# Altium schematic sheet mcu.schdoc
size 324 x 125 mm
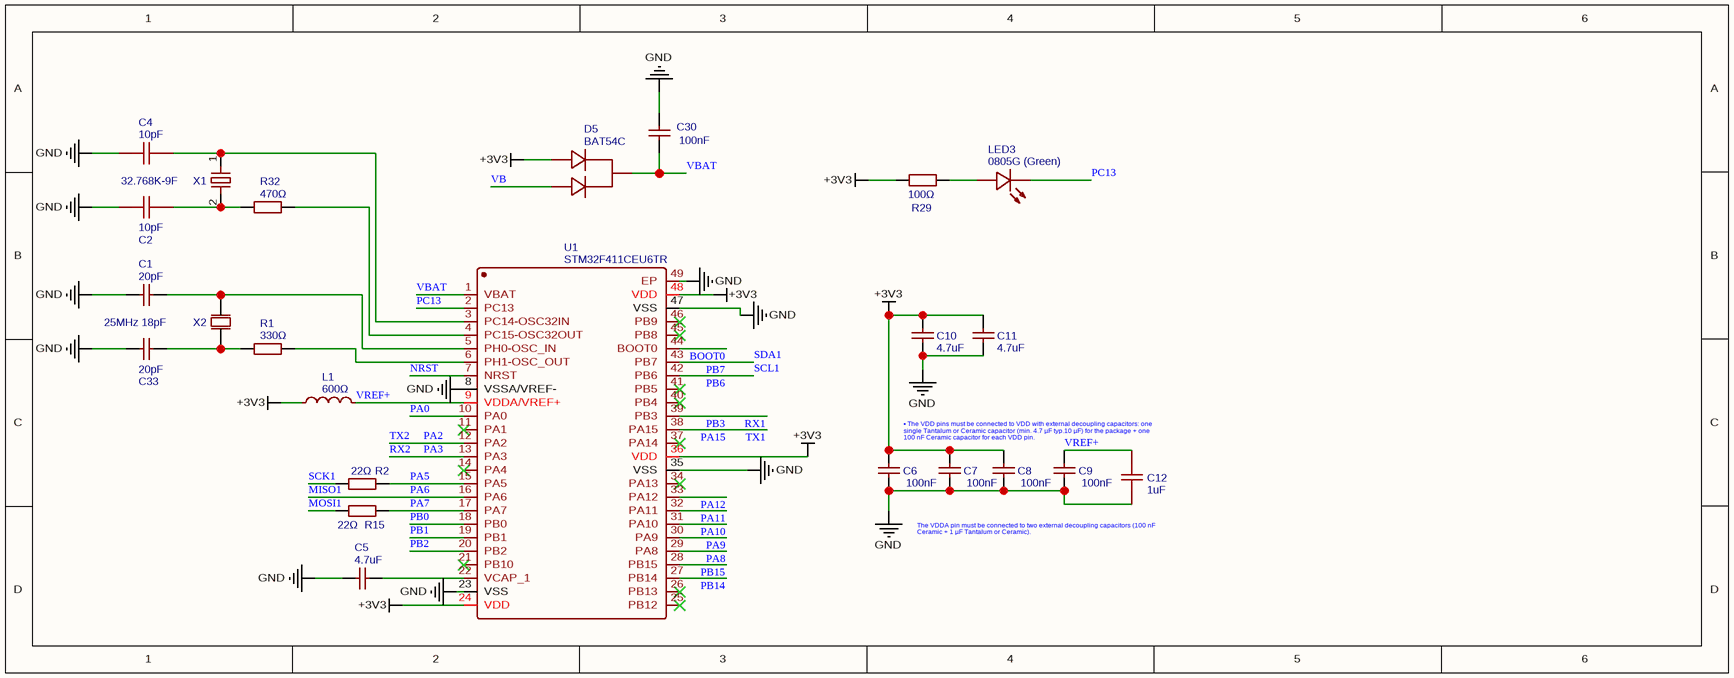
[diagram p0: mcu.schdoc]

## Parts
C1  20pF  [C0402]
C2  10pF  [C0402]
C4  10pF  [C0402]
C5  4.7uF  [C0402]
C6  100nF  [C0402]
C7  100nF  [C0402]
C8  100nF  [C0402]
C9  100nF  [C0402]
C10  4.7uF  [C0402]
C11  4.7uF  [C0402]
C12  1uF  [C0402]
C30  100nF  [C0402]
C33  20pF  [C0402]
D5  BAT54C  [SOT-23-3_L2.9-W1.6-P1.90-LS2.8-BR]
L1  600Ω  [L0603]
LED3  0805G (Green)  [LED0805-R-RD]
R1  330Ω  [R0402]
R2  22Ω  [R0402]
R15  22Ω  [R0402]
R29  100Ω  [R0402]
R32  470Ω  [R0402]
U1  STM32F411CEU6TR  [UFQFPN-48_L7.0-W7.0-P0.50-BL-EP5.6]
X1  32.768K-9F  [CRYSTAL-SMD_L3.2-W1.5-1]
X2  25MHz 18pF  [OSC-SMD_2P-L5.0-W3.2]

## Nets
+3V3: C6.2 C7.2 C8.2 C10.1 C11.1 D5.1(A1) L1.1 R29.1 U1.24(VDD) U1.36(VDD) U1.48(VDD)
GND: C1.1 C2.1 C4.1 C5.1 C6.1 C7.1 C8.1 C9.1 C10.2 C11.2 C12.1 C30.2 C33.1 U1.8(VSSA/VREF-) U1.23(VSS) U1.35(VSS) U1.47(VSS) U1.49(EP)
BOOT0: U1.44(BOOT0)
MISO1: U1.16(PA6)  [also labelled PA6]
MOSI1: R15.1
NRST: U1.7(NRST)
PA0: U1.10(PA0)
PA2: U1.12(PA2)  [also labelled TX2]
PA3: U1.13(PA3)  [also labelled RX2]
PA5: R2.2 U1.15(PA5)
PA7: R15.2 U1.17(PA7)
PA8: U1.29(PA8)
PA9: U1.30(PA9)
PA10: U1.31(PA10)
PA11: U1.32(PA11)
PA12: U1.33(PA12)
PA15: U1.38(PA15)  [also labelled TX1]
PB0: U1.18(PB0)
PB1: U1.19(PB1)
PB2: U1.20(PB2)
PB3: U1.39(PB3)  [also labelled RX1]
PB6: U1.42(PB6)  [also labelled SCL1]
PB7: U1.43(PB7)  [also labelled SDA1]
PB14: U1.27(PB14)
PB15: U1.28(PB15)
PC13: LED3.2(K) U1.2(PC13)
SCK1: R2.1
VB: D5.2(A2)
VBAT: C30.1 D5.3(K) U1.1(VBAT)
VREF+: C9.2 C12.2 L1.2 U1.9(VDDA/VREF+)
NetC1_2: C1.2 U1.5(PH0-OSC_IN) X2.1(OSC1)
NetC2_2: C2.2 R32.1 X1.2
NetC4_2: C4.2 U1.3(PC14-OSC32IN) X1.1
NetC5_2: C5.2 U1.22(VCAP_1)
NetC33_2: C33.2 R1.1 X2.2(OSC2)
NetLED3_1: LED3.1(A) R29.2
NetR1_2: R1.2 U1.6(PH1-OSC_OUT)
NetR32_2: R32.2 U1.4(PC15-OSC32OUT)

Not connected (* = marked no-connect by the designer): U1 11(PA1)* 14(PA4)* 21(PB10)* 25(PB12)* 26(PB13)* 34(PA13)* 37(PA14)* 40(PB4)* 41(PB5)* 45(PB8)* 46(PB9)*

## Notes on the sheet
- • The VDD pins must be connected to VDD with external decoupling capacitors: one
  single Tantalum or Ceramic capacitor (min. 4.7 µF typ.10 µF) for the package + one
  100 nF Ceramic capacitor for each VDD pin.
- The VDDA pin must be connected to two external decoupling capacitors (100 nF
  Ceramic + 1 µF Tantalum or Ceramic).

## Library data of the parts
C1 C33 = 20pF: Manufacturer: FH(风华); Manufacturer Part: 0402CG200J500NT; nameAlias: Value; Supplier: LCSC; Supplier Part: C1554; JLCPCB Part Class: Basic Part; spicePre: C; spiceSymbolName: 0402CG200J500NT
C2 C4 = 10pF: Manufacturer: SAMSUNG(三星); Manufacturer Part: CL05C100JB5NNNC; nameAlias: Value; Supplier: LCSC; Supplier Part: C32949; JLCPCB Part Class: Basic Part; spicePre: C; spiceSymbolName: CL05C100JB5NNNC
C5 C10 C11 = 4.7uF: Manufacturer Part: CL05A475MP5NRNC; Manufacturer: SAMSUNG(三星); nameAlias: Value; Supplier: LCSC; Supplier Part: C23733; JLCPCB Part Class: Basic Part; spicePre: C; spiceSymbolName: CL05A475MP5NRNC
C6-C9 C30 = 100nF: Manufacturer Part: CL05B104KO5NNNC; Manufacturer: SAMSUNG(三星); nameAlias: Value; Supplier: LCSC; Supplier Part: C1525; JLCPCB Part Class: Basic Part; spicePre: C; spiceSymbolName: CL05B104KO5NNNC
C12 = 1uF: Manufacturer: SAMSUNG(三星); Manufacturer Part: CL05A105KA5NQNC; nameAlias: Value; Supplier: LCSC; Supplier Part: C52923; JLCPCB Part Class: Basic Part; spicePre: C; spiceSymbolName: CL05A105KA5NQNC
D5 = BAT54C: Manufacturer: CJ(江苏长电/长晶); Supplier: LCSC; Manufacturer Part: BAT54C; Supplier Part: C2135; JLCPCB Part Class: Extended Part; spicePre: D; spiceSymbolName: BAT54C
L1 = 600Ω: Manufacturer: Sunlord(顺络); Manufacturer Part: GZ1608D601TF; nameAlias: Value; Supplier: LCSC; Supplier Part: C1002; JLCPCB Part Class: Basic Part; spicePre: L; spiceSymbolName: GZ1608D601TF
LED3 = 0805G (Green): Manufacturer: KENTO; Manufacturer Part: KT-0805翠绿; Supplier: LCSC; Supplier Part: C2297; JLCPCB Part Class: Basic Part; spicePre: L; spiceSymbolName: 0805G (Green)
R1 = 330Ω: Manufacturer: UNI-ROYAL(厚声); Manufacturer Part: 0402WGF3300TCE; nameAlias: Value; Supplier: LCSC; Supplier Part: C25104; JLCPCB Part Class: Basic Part; spicePre: R; spiceSymbolName: 0402WGF3300TCE
R2 R15 = 22Ω: Manufacturer: UNI-ROYAL(厚声); Manufacturer Part: 0402WGF220JTCE; nameAlias: Value; Supplier: LCSC; Supplier Part: C25092; JLCPCB Part Class: Basic Part; spicePre: R; spiceSymbolName: 0402WGF220JTCE
R29 = 100Ω: Manufacturer: UNI-ROYAL(厚声); Manufacturer Part: 0402WGF1000TCE; nameAlias: Value; Supplier: LCSC; Supplier Part: C25076; JLCPCB Part Class: Basic Part; spicePre: R; spiceSymbolName: 0402WGF1000TCE
R32 = 470Ω: Manufacturer: UNI-ROYAL(厚声); Manufacturer Part: 0402WGF4700TCE; nameAlias: Value; Supplier: LCSC; Supplier Part: C25117; JLCPCB Part Class: Basic Part; spicePre: R; spiceSymbolName: 0402WGF4700TCE
U1 = STM32F411CEU6TR: Manufacturer: ST(意法半导体); Contributor: LCSC; Supplier: LCSC; Supplier Part: C2054095; Manufacturer Part: STM32F411CEU6TR; JLCPCB Part Class: Extended Part; spicePre: U; spiceSymbolName: STM32F411CEU6TR
X1 = 32.768K-9F: Manufacturer: null; Manufacturer Part: CMTV-T1A-32.768K-12.5PF-20PPM; Contributor: lcsc; Supplier: LCSC; Supplier Part: C9900013504; JLCPCB Part Class: Extended Part; spicePre: X; spiceSymbolName: CMTV-T1A-32.768K-12.5PF-20PPM
X2 = 25MHz 18pF: Manufacturer: ABRACON; Manufacturer Part: ABM3-25.000MHZ-D2Y-T; nameAlias: Value; Contributor: LCSC; Supplier: LCSC; Supplier Part: C148312; JLCPCB Part Class: Extended Part; spicePre: X; spiceSymbolName: ABM3-25.000MHZ-D2Y-T